# Altium schematic sheet Connectors.SchDoc: Connectors
size OrCAD A; Date: Not used; ApprovedBy: Not used; CheckedBy: Not used; Author: Not used; CompanyName: STMicroelectronics; DrawnBy: Not used; Engineer: Not used; Organization: Not used; Address1: Not used; Address2: Not used; Address3: Not used; Address4: Not used; DocumentNumber: FB-001; Revision: A; SheetNumber: 1; SheetTotal: 5; CurrentTime: Not used; CurrentDate: Not used; Time: Not used; DocumentFullPathAndName: Not used; DocumentName: Not used; ModifiedDate: Not used; ImagePath: Not used; ProjectName: Not used; Application_BuildNumber: Not used
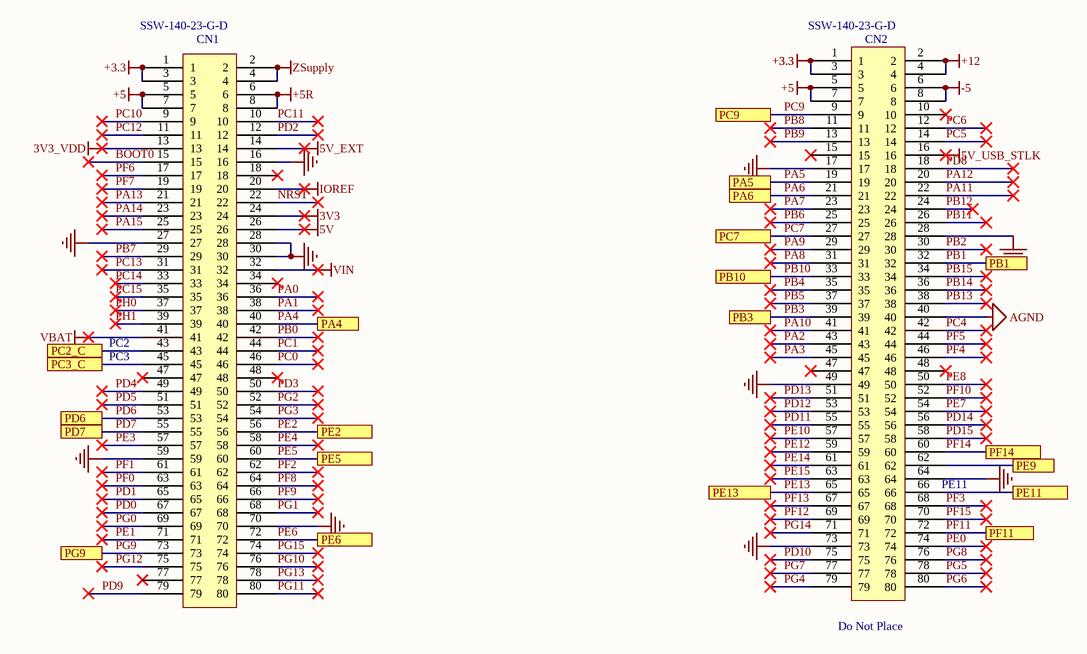
[diagram p0: Connectors.SchDoc]

## Parts
CN1  Do Not Place  [SSW-140-23-G-D]  (value not drawn)
CN2  Do Not Place  [SSW-140-23-G-D]

## Ports
PA4, PA5, PA6, PB1, PB3, PB10, PC2_C, PC3_C, PC7, PC9, PD6, PD7, PE2, PE5, PE6, PE9, PE11, PE13, PF11, PF14, PG9

## Nets
3V3: CN1.24
3V3_VDD: CN1.13
5V: CN1.26
5V_EXT: CN1.14
5V_USB_STLK: CN2.16
+3.3: CN1.1 CN1.3 CN2.1 CN2.3
+5: CN1.5 CN1.7 CN2.5 CN2.7
+5R: CN1.6 CN1.8
+12: CN2.2 CN2.4
-5: CN2.6 CN2.8
AGND: CN2.40
GND: CN1.16 CN1.27 CN1.28 CN1.30 CN1.59 CN1.70 CN2.17 CN2.28 CN2.49 CN2.64 CN2.73
IOREF: CN1.20
VBAT: CN1.41
VIN: CN1.32
ZSupply: CN1.2 CN1.4
BOOT0: CN1.15
NRST: CN1.22
PA0: CN1.36
PA1: CN1.38
PA2: CN2.43
PA3: CN2.45
PA4: CN1.40 ; port PA4
PA5: CN2.19 ; port PA5
PA6: CN2.21 ; port PA6
PA7: CN2.23
PA8: CN2.31
PA9: CN2.29
PA10: CN2.41
PA11: CN2.22
PA12: CN2.20
PA13: CN1.21
PA14: CN1.23
PA15: CN1.25
PB0: CN1.42
PB1: CN2.32 ; port PB1
PB2: CN2.30
PB3: CN2.39 ; port PB3
PB4: CN2.35
PB5: CN2.37
PB6: CN2.25
PB7: CN1.29
PB8: CN2.11
PB9: CN2.13
PB10: CN2.33 ; port PB10
PB11: CN2.26
PB12: CN2.24
PB13: CN2.38
PB14: CN2.36
PB15: CN2.34
PC0: CN1.46
PC1: CN1.44
PC2_C: CN1.43 ; port PC2_C
PC3_C: CN1.45 ; port PC3_C
PC4: CN2.42
PC5: CN2.14
PC6: CN2.12
PC7: CN2.27 ; port PC7
PC9: CN2.9 ; port PC9
PC10: CN1.9
PC11: CN1.10
PC12: CN1.11
PC13: CN1.31
PC14: CN1.33
PC15: CN1.35
PD0: CN1.67
PD1: CN1.65
PD2: CN1.12
PD3: CN1.50
PD4: CN1.49
PD5: CN1.51
PD6: CN1.53 ; port PD6
PD7: CN1.55 ; port PD7
PD8: CN2.18
PD9: CN1.79
PD10: CN2.75
PD11: CN2.55
PD12: CN2.53
PD13: CN2.51
PD14: CN2.56
PD15: CN2.58
PE0: CN2.74
PE1: CN1.71
PE2: CN1.56 ; port PE2
PE3: CN1.57
PE4: CN1.58
PE5: CN1.60 ; port PE5
PE6: CN1.72 ; port PE6
PE7: CN2.54
PE8: CN2.50
PE9: CN2.62 ; port PE9
PE10: CN2.57
PE11: CN2.66 ; port PE11
PE12: CN2.59
PE13: CN2.65 ; port PE13
PE14: CN2.61
PE15: CN2.63
PF0: CN1.63
PF1: CN1.61
PF2: CN1.62
PF3: CN2.68
PF4: CN2.46
PF5: CN2.44
PF6: CN1.17
PF7: CN1.19
PF8: CN1.64
PF9: CN1.66
PF10: CN2.52
PF11: CN2.72 ; port PF11
PF12: CN2.69
PF13: CN2.67
PF14: CN2.60 ; port PF14
PF15: CN2.70
PG0: CN1.69
PG1: CN1.68
PG2: CN1.52
PG3: CN1.54
PG4: CN2.79
PG5: CN2.78
PG6: CN2.80
PG7: CN2.77
PG8: CN2.76
PG9: CN1.73 ; port PG9
PG10: CN1.76
PG11: CN1.80
PG12: CN1.75
PG13: CN1.78
PG14: CN2.71
PG15: CN1.74
PH0: CN1.37
PH1: CN1.39

Not connected (* = marked no-connect by the designer): CN1 18* 34* 47* 48* 77*; CN2 10* 15* 47* 48*

## Notes on the sheet
- PC2
- PC3
- (near CN2) PE11
- Title
- Size:
- Date:
- Orcad A
- Number:
- Time:
- Revision:
- Sheet
- of
- ZLS Corporation
- 7801 North Lamar Blvd.
- Suite E-184
- Austin, Texas 78752  USA
- (512) 453-0288
- File:

## Library data of the parts
CN1 CN2 = SSW-140-23-G-D: Conn Socket Strip SKT 80 POS 2.54mm Solder ST Thru-Hole; Manufacturer: Samtec; Number of Contacts: 80; Gender: Female; Supplier 1: Avnet; Supplier Part Number 1: SSW-140-23-G-D; Manufacturer Part Number: SSW-140-23-G-D; Stock 1: 0; Pricing 1: 1=13.99000, 10=13.29000, 25=12.59000, 50=12.09000, 100=11.29000 (USD); RoHS: Yes; Mount: Through Hole; Contact Plating: Gold; Number of Rows: 2; Packaging: Bulk; Termination: Solder; Pitch: 2.54mm; Radiation Hardening: No; ComponentLink1URL: http://www.samtec.com/documents/webfiles/pdf/SSQ_TH.PDF?src-supplier=Avnet; ComponentLink1Description: http://www.samtec.com/documents/webfiles/pdf/SSQ_TH.PDF?src-supplier=Avnet